# Altium schematic sheet green.SchDoc
size A4
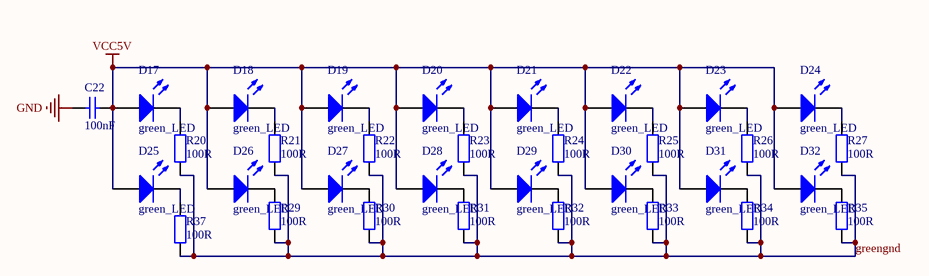
[diagram p0: green.SchDoc]

## Parts
C22  100nF  [CC2012-0805]
D17  green_LED  [LED5MM]
D18  green_LED  [LED5MM]
D19  green_LED  [LED5MM]
D20  green_LED  [LED5MM]
D21  green_LED  [LED5MM]
D22  green_LED  [LED5MM]
D23  green_LED  [LED5MM]
D24  green_LED  [LED5MM]
D25  green_LED  [LED5MM]
D26  green_LED  [LED5MM]
D27  green_LED  [LED5MM]
D28  green_LED  [LED5MM]
D29  green_LED  [LED5MM]
D30  green_LED  [LED5MM]
D31  green_LED  [LED5MM]
D32  green_LED  [LED5MM]
R20  100R  [CR2012-0805]
R21  100R  [CR2012-0805]
R22  100R  [CR2012-0805]
R23  100R  [CR2012-0805]
R24  100R  [CR2012-0805]
R25  100R  [CR2012-0805]
R26  100R  [CR2012-0805]
R27  100R  [CR2012-0805]
R29  100R  [CR2012-0805]
R30  100R  [CR2012-0805]
R31  100R  [CR2012-0805]
R32  100R  [CR2012-0805]
R33  100R  [CR2012-0805]
R34  100R  [CR2012-0805]
R35  100R  [CR2012-0805]
R37  100R  [CR2012-0805]

## Nets
GND: C22.2
VCC5V: C22.1 D17.1(A) D18.1(A) D19.1(A) D20.1(A) D21.1(A) D22.1(A) D23.1(A) D24.1(A) D25.1(A) D26.1(A) D27.1(A) D28.1(A) D29.1(A) D30.1(A) D31.1(A) D32.1(A)
greengnd: R20.1 R21.1 R22.1 R23.1 R24.1 R25.1 R26.1 R27.1 R29.1 R30.1 R31.1 R32.1 R33.1 R34.1 R35.1 R37.1
NetD17_2: D17.2(K) R20.2
NetD18_2: D18.2(K) R21.2
NetD19_2: D19.2(K) R22.2
NetD20_2: D20.2(K) R23.2
NetD21_2: D21.2(K) R24.2
NetD22_2: D22.2(K) R25.2
NetD23_2: D23.2(K) R26.2
NetD24_2: D24.2(K) R27.2
NetD25_2: D25.2(K) R37.2
NetD26_2: D26.2(K) R29.2
NetD27_2: D27.2(K) R30.2
NetD28_2: D28.2(K) R31.2
NetD29_2: D29.2(K) R32.2
NetD30_2: D30.2(K) R33.2
NetD31_2: D31.2(K) R34.2
NetD32_2: D32.2(K) R35.2

## Library data of the parts
C22 = Cap Semi: Capacitor (Semiconductor SIM Model); Published: 8-Jun-2000; LatestRevisionDate: 17-Jul-2002; LatestRevisionNote: Re-released for DXP Platform.; PackageReference: C1206; Publisher: Altium Limited
D17-D32 = LED: Typical RED GaAs LED; Published: 8-Jun-2000; LatestRevisionDate: 08-Jul-2005; LatestRevisionNote: Mech Layer 1 removed.; PackageReference: LED-1; Publisher: Altium Limited
R20-R27 R29-R35 R37 = Res2: Resistor; Published: 8-Jun-2000; Revision: July-2002: Re-released for DXP Platform.; Publisher: Altium Limited; Value: 100R